# Altium project GPS_TRACKER_IREC.PrjPcb
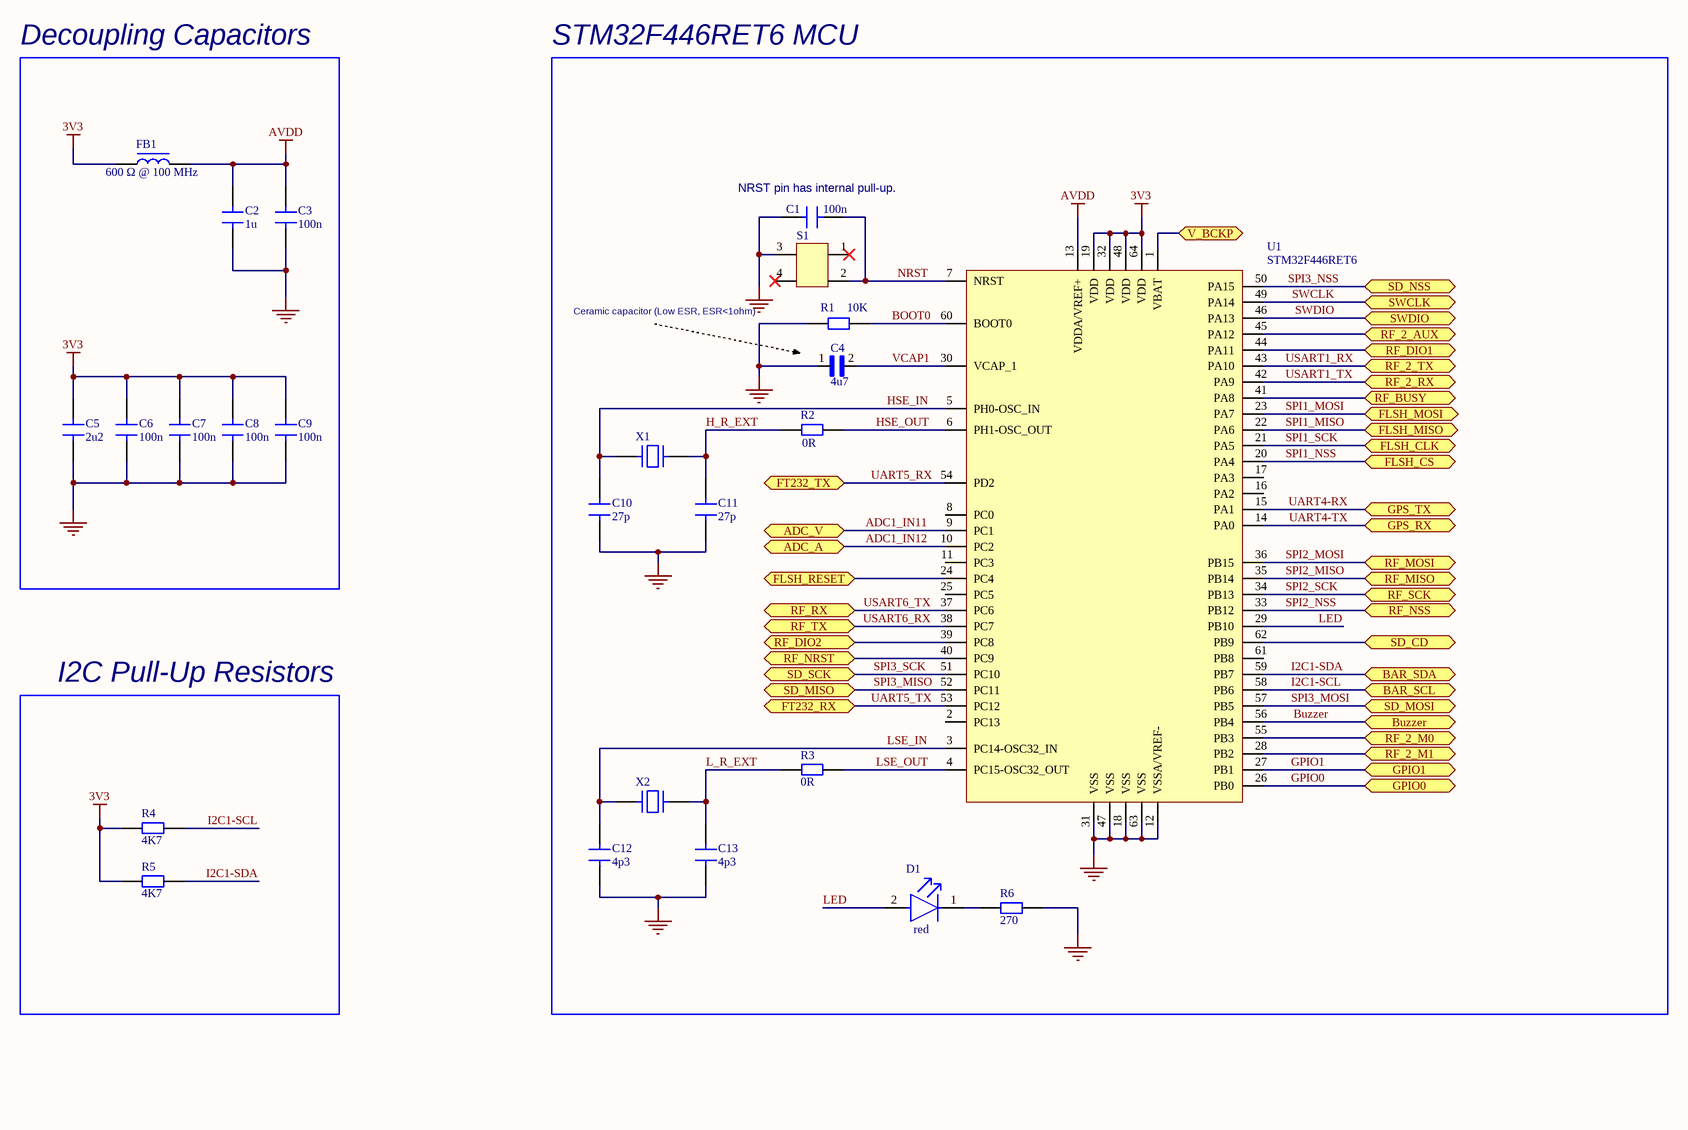
[diagram p0: MCU.SchDoc]
1 sheet, 25 parts. Net scope: flat (ports and power ports of the same name join across sheets).
Board files: V1.PcbDoc, V2_1mini.PcbDoc, V1_x2LoRa.PcbDoc, ciftLoRaTracker.PcbDoc, GOK-HAN_TRACKER.PcbDoc

## Sheet MCU.SchDoc
size A3; SheetNumber: 1; SheetTotal: 4

### Parts
C1  100n  [CAP 0603]
C2  1u  [CAP 0805]
C3  100n  [CAP 0805]
C4  4u7  [CAPC3216X180N]
C5  2u2  [CAP 0805]
C6  100n  [CAP 0805]
C7  100n  [CAP 0805]
C8  100n  [CAP 0805]
C9  100n  [CAP 0805]
C10  27p  [CAP 0805]
C11  27p  [CAP 0805]
C12  4p3  [CAP 0805]
C13  4p3  [CAP 0805]
D1  red  [FP-LTST-C170GKT-MFG]
FB1  600 Ω @ 100 MHz  [FB 0805]
R1  10K  [RES 0805]
R2  0R  [RES 0805]
R3  0R  [RES 0805]
R4  4K7  [RES 0805]
R5  4K7  [RES 0805]
R6  270  [RES 0805]
S1  FSM4JSMATR  [FSM4JSMATR]  (value not drawn)
U1  STM32F446RET6  [STM32F446RET6]
X1  ABM3-8.000MHZ-D2Y-T  [ABM3-8.000MHZ-D2Y-T]  (value not drawn)
X2  ABS25-32.768KHZ-6-T  [ABS25-32.768KHZ-6-T]  (value not drawn)

### Blocks framed on the sheet
Decoupling Capacitors: C2 C3 C5-C9 FB1
STM32F446RET6 MCU: C1 C4 C10-C13 D1 R1-R3 R6 S1 U1 X1 X2
I2C Pull-Up Resistors: R4 R5

### Ports
ADC_A (bidir, see POWER[3D]), ADC_V (bidir, see POWER[1D]), BAR_SCL (bidir, see CONNECTORS[7C], PERIPHERALS[6B]), BAR_SDA (bidir, see CONNECTORS[7C], PERIPHERALS[6B]), Buzzer (bidir, see PERIPHERALS[1C]), FLSH_CLK (bidir, see PERIPHERALS[5B]), FLSH_CS (bidir, see PERIPHERALS[4A]), FLSH_MISO (bidir, see PERIPHERALS[4B]), FLSH_MOSI (bidir, see PERIPHERALS[5B]), FLSH_RESET (bidir, see PERIPHERALS[6B]), FT232_RX (bidir, see CONNECTORS[3A]), FT232_TX (bidir, see CONNECTORS[3A]), GPIO0 (bidir, see CONNECTORS[3C]), GPIO1 (bidir, see CONNECTORS[3C]), GPS_RX (bidir, see PERIPHERALS[2B]), GPS_TX (bidir, see PERIPHERALS[2B]), RF_2_AUX (bidir, see PERIPHERALS[7C]), RF_2_M0 (bidir, see PERIPHERALS[7C]), RF_2_M1 (bidir, see PERIPHERALS[7C]), RF_2_RX (bidir, see PERIPHERALS[7C]), RF_2_TX (bidir, see PERIPHERALS[7C]), RF_BUSY (bidir, see PERIPHERALS[4C]), RF_DIO1 (bidir, see PERIPHERALS[4C]), RF_DIO2 (bidir, see PERIPHERALS[4C]), RF_MISO (bidir, see PERIPHERALS[4C]), RF_MOSI (bidir, see PERIPHERALS[4C]), RF_NRST (bidir, see PERIPHERALS[4C]), RF_NSS (bidir, see PERIPHERALS[4D]), RF_RX (bidir, see PERIPHERALS[4C]), RF_SCK (bidir, see PERIPHERALS[4C]), RF_TX (bidir, see PERIPHERALS[4C]), SD_CD (bidir, see CONNECTORS[5B]), SD_MISO (bidir, see CONNECTORS[5A]), SD_MOSI (bidir, see CONNECTORS[5A]), SD_NSS (bidir, see CONNECTORS[5B]), SD_SCK (bidir, see CONNECTORS[5A]), SWCLK (bidir, see CONNECTORS[2C], CONNECTORS[7B]), SWDIO (bidir, see CONNECTORS[2C], CONNECTORS[7B]), V_BCKP (bidir, see PERIPHERALS[2A], POWER[4D])

### Nets
3V3: C5.2 C6.2 C7.2 C8.2 C9.2 FB1.1 R4.1 R5.1 U1.19(VDD) U1.32(VDD) U1.48(VDD) U1.64(VDD)
AVDD: C2.2 C3.2 FB1.2 U1.13(VDDA/VREF+)
GND: C1.1 C2.1 C3.1 C4.1 C5.1 C6.1 C7.1 C8.1 C9.1 C10.1 C11.1 C12.1 C13.1 R1.1 R6.1 S1.3 U1.12(VSSA/VREF-) U1.18(VSS) U1.31(VSS) U1.47(VSS) U1.63(VSS)
ADC1_IN11: U1.9(PC1) ; port ADC_V
ADC1_IN12: U1.10(PC2) ; port ADC_A
BOOT0: R1.2 U1.60(BOOT0)
Buzzer: U1.56(PB4) ; port Buzzer
GPIO0: U1.26(PB0) ; port GPIO0
GPIO1: U1.27(PB1) ; port GPIO1
H_R_EXT: C11.2 R2.1 X1.2
HSE_IN: C10.2 U1.5(PH0-OSC_IN) X1.1
HSE_OUT: R2.2 U1.6(PH1-OSC_OUT)
I2C1-SCL: R4.2 U1.58(PB6) ; port BAR_SCL
I2C1-SDA: R5.2 U1.59(PB7) ; port BAR_SDA
L_R_EXT: C13.2 R3.1 X2.4
LED: D1.2(A) U1.29(PB10)
LSE_IN: C12.2 U1.3(PC14-OSC32_IN) X2.1
LSE_OUT: R3.2 U1.4(PC15-OSC32_OUT)
NRST: C1.2 S1.2 U1.7(NRST)
SPI1_MISO: U1.22(PA6) ; port FLSH_MISO
SPI1_MOSI: U1.23(PA7) ; port FLSH_MOSI
SPI1_NSS: U1.20(PA4) ; port FLSH_CS
SPI1_SCK: U1.21(PA5) ; port FLSH_CLK
SPI2_MISO: U1.35(PB14) ; port RF_MISO
SPI2_MOSI: U1.36(PB15) ; port RF_MOSI
SPI2_NSS: U1.33(PB12) ; port RF_NSS
SPI2_SCK: U1.34(PB13) ; port RF_SCK
SPI3_MISO: U1.52(PC11) ; port SD_MISO
SPI3_MOSI: U1.57(PB5) ; port SD_MOSI
SPI3_NSS: U1.50(PA15) ; port SD_NSS
SPI3_SCK: U1.51(PC10) ; port SD_SCK
SWCLK: U1.49(PA14) ; port SWCLK
SWDIO: U1.46(PA13) ; port SWDIO
UART4-RX: U1.15(PA1) ; port GPS_TX
UART4-TX: U1.14(PA0) ; port GPS_RX
UART5_RX: U1.54(PD2) ; port FT232_TX
UART5_TX: U1.53(PC12) ; port FT232_RX
USART1_RX: U1.43(PA10) ; port RF_2_TX
USART1_TX: U1.42(PA9) ; port RF_2_RX
USART6_RX: U1.38(PC7) ; port RF_TX
USART6_TX: U1.37(PC6) ; port RF_RX
VCAP1: C4.2 U1.30(VCAP_1)
NetD1_1: D1.1(C) R6.2
NetU1_1: U1.1(VBAT) ; port V_BCKP
NetU1_24: U1.24(PC4) ; port FLSH_RESET
NetU1_28: U1.28(PB2) ; port RF_2_M1
NetU1_39: U1.39(PC8) ; port RF_DIO2
NetU1_40: U1.40(PC9) ; port RF_NRST
NetU1_41: U1.41(PA8) ; port RF_BUSY
NetU1_44: U1.44(PA11) ; port RF_DIO1
NetU1_45: U1.45(PA12) ; port RF_2_AUX
NetU1_55: U1.55(PB3) ; port RF_2_M0
NetU1_62: U1.62(PB9) ; port SD_CD

Not connected (* = marked no-connect by the designer): S1 1* 4*; U1 2(PC13) 8(PC0) 11(PC3) 16(PA2) 17(PA3) 25(PC5) 61(PB8)

### Notes on the sheet
- (near C1) NRST pin has internal pull-up.
- Ceramic capacitor (Low ESR, ESR<1ohm)

### Library data of the parts
C1 = CAP 0603 50V: Capacitor SMD 0603 50V
C2 C3 C6-C13 = CAP 0805 50V: Capacitor SMD 0805 50V
C4 = UMK316ABJ475MLHT: 4.7uF, CAP, MLCC, 1206, 50V, X5R, 4.7UF20%, T&R; Package: None; Price: None; Value: *; MP: UMK316ABJ475MLHT; Availability: Unavailable
C5 = CAP 0805 25V: Capacitor SMD 0805 25V
D1 = CMP-1674-00002-6: LED GREEN CLEAR SMD; Dominant Wavelength: 569nm; Lens Style: Diffused; Forward Voltage: 2.1V; Number of Elements: 1; Wavelength: 565nm; Luminous Intensity: 6mcd; Test Current: 10mA; Power Dissipation: 100mW; Reverse Voltage: 5V; Forward Current: 30mA; Viewing Angle: 130°; Lens Color: Colorless; Min Operating Temperature: -55°C; Number of Pins: 2; Max Operating Temperature: 85°C; Color: Green; Radiation Hardening: No; Illumination Color: Green; Case Code (Metric): 2012; Lens Transparency: Clear; Case/Package: 0805; Width: 1.25mm; Case Code (Imperial): 0805; Package Quantity: 1; Height: 1.1mm; Depth: 1.25mm; Length: 2mm; Power Rating: 100mW; Lead Free: Lead Free; Number of LEDs: 1; Packaging: Tape and Reel; Mount: Surface Mount; Voltage: 5V
FB1 = FB 0805: Ferrite Bead SMD 0805
R1-R6 = RES 0805: Resistor SMD 0805
S1 = FSM4JSMATR: Switch Tactile OFF (ON) SPST Round Button Gull Wing 0.05A 24VDC 1.57N SMD T/R; Manufacturer: TE Connectivity Alcoswitch; Supplier 1: Digi-Key; Manufacturer Part Number: FSM4JSMATR; RoHS: Yes; Category: Pushbutton Switches; Stock 1: 84996; Pricing 1: 1=0,36, 10=0,351, 25=0,33, 100=0,2866, 250=0,26, 500=0,24188 (USD); ComponentLink1URL: https://datasheet.ciiva.com/16320/eng-cs-1308111-1-switches-core-program-catalog-0308-16320065.pdf?src-supplier=Future+Electronics; ComponentLink1Description: https://datasheet.ciiva.com/16320/eng-cs-1308111-1-switches-core-program-catalog-0308-16320065.pdf?src-supplier=Future+Electronics; ComponentLink2URL: https://datasheet.ciiva.com/1530/1683375-1530944.pdf?src-supplier=Element14; ComponentLink2Description: https://datasheet.ciiva.com/1530/1683375-1530944.pdf?src-supplier=Element14; ComponentLink3URL: https://datasheet.ciiva.com/23765/1486934-23765878.pdf?src-supplier=Newark; ComponentLink3Description: https://datasheet.ciiva.com/23765/1486934-23765878.pdf?src-supplier=Newark; ComponentLink4URL: https://datasheet.ciiva.com/7638/921681-7638037.pdf?src-supplier=Element14; ComponentLink4Description: https://datasheet.ciiva.com/7638/921681-7638037.pdf?src-supplier=Element14
U1 = STM32F446RET6: ARM® Cortex®-M4 STM32 F4 Microcontroller IC 32-Bit 180MHz 512KB (512K x 8) FLASH 64-LQFP (10x10); Manufacturer: STMicroelectronics; Supplier 1: Mouser; Manufacturer Part Number: STM32F446RET6; RoHS: Yes; Category: Microcontrollers; Stock 1: 2954; Pricing 1: 1=12,45, 10=11,25, 50=10,54, 100=9,5, 1000=6,72, 10000=6,72 (USD); ComponentLink1URL: http://www.mouser.com/ds/2/389/stm32f446mc-956216.pdf?src-supplier=Mouser; ComponentLink1Description: http://www.mouser.com/ds/2/389/stm32f446mc-956216.pdf?src-supplier=Mouser; ComponentLink2URL: http://www.farnell.com/datasheets/2309063.pdf?src-supplier=Farnell; ComponentLink2Description: http://www.farnell.com/datasheets/2309063.pdf?src-supplier=Farnell; ComponentLink3URL: https://datasheet.octopart.com/STM32F446RET6-STMicroelectronics-datasheet-58295083.pdf?src-supplier=Future+Electronics; ComponentLink3Description: https://datasheet.octopart.com/STM32F446RET6-STMicroelectronics-datasheet-58295083.pdf?src-supplier=Future+Electronics; ComponentLink4URL: http://www.st.com/content/ccc/resource/technical/document/datasheet/65/cb/75/50/53/d6/48/24/DM00141306.pdf/files/DM00141306.pdf/jcr:content/translations/en.DM00141306.pdf?src-supplier=Digi-Key; ComponentLink4Description: http://www.st.com/content/ccc/resource/technical/document/datasheet/65/cb/75/50/53/d6/48/24/DM00141306.pdf/files/DM00141306.pdf/jcr:content/translations/en.DM00141306.pdf?src-supplier=Digi-Key; ComponentLink5URL: http://www.farnell.com/datasheets/2309063.pdf?src-supplier=Element14; ComponentLink5Description: http://www.farnell.com/datasheets/2309063.pdf?src-supplier=Element14; ComponentLink6URL: https://datasheet.octopart.com/STM32F446RET6-STMicroelectronics-datasheet-41797127.pdf?src-supplier=Element14; ComponentLink6Description: https://datasheet.octopart.com/STM32F446RET6-STMicroelectronics-datasheet-41797127.pdf?src-supplier=Element14; ComponentLink7URL: http://www.farnell.com/datasheets/2309063.pdf?src-supplier=Newark; ComponentLink7Description: http://www.farnell.com/datasheets/2309063.pdf?src-supplier=Newark; ComponentLink8URL: https://datasheet.octopart.com/STM32F446RET6-STMicroelectronics-datasheet-83961502.pdf?src-supplier=SHENGYU+ELECTRONICS; ComponentLink8Description: https://datasheet.octopart.com/STM32F446RET6-STMicroelectronics-datasheet-83961502.pdf?src-supplier=SHENGYU+ELECTRONICS
X1 = ABM3-8.000MHZ-D2Y-T: Crystal 8MHz ±20ppm (Tol) ±30ppm (Stability) 18pF FUND 140Ohm 2-Pin Mini-CSMD T/R; Manufacturer: Abracon; Supplier 1: Future Electronics; Manufacturer Part Number: ABM3-8.000MHZ-D2Y-T; RoHS: Yes; Category: Crystals; Stock 1: 237000; Pricing 1: 1000=0,325, 2000=0,275, 3000=0,315, 4000=0,27, 5000=0,31, 10000=0,305, 20000=0,295 (USD); Reach SVHC Compliant: 4187SVHC; ComponentLink1URL: https://datasheet.ciiva.com/862/abm3-862465.pdf?src-supplier=Digikey; ComponentLink1Description: https://datasheet.ciiva.com/862/abm3-862465.pdf?src-supplier=Digikey
X2 = ABS25-32.768KHZ-6-T: Crystal, Plastic Molded 32.768Khz, 6Pf, 20Ppm-40+85C, 8 X 3.8 X 2.5 Rohs Compliant: Yes; Manufacturer: Abracon; Supplier 1: Future Electronics; Manufacturer Part Number: ABS25-32.768KHZ-6-T; RoHS: Yes; Category: Crystals; Stock 1: 399000; Pricing 1: 3000=0,375, 6000=0,365, 9000=0,365, 12000=0,36, 15000=0,35 (USD); ComponentLink1URL: https://datasheet.ciiva.com/854/abs25-854528.pdf?src-supplier=Digi-Key; ComponentLink1Description: https://datasheet.ciiva.com/854/abs25-854528.pdf?src-supplier=Digi-Key; ComponentLink2URL: https://datasheet.ciiva.com/26909/getdatasheetpartid-722397-26909970.pdf?src-supplier=Verical; ComponentLink2Description: https://datasheet.ciiva.com/26909/getdatasheetpartid-722397-26909970.pdf?src-supplier=Verical; ComponentLink3URL: https://datasheet.ciiva.com/854/abs25-854527.pdf?src-supplier=Digi-Key; ComponentLink3Description: https://datasheet.ciiva.com/854/abs25-854527.pdf?src-supplier=Digi-Key; ComponentLink4URL: https://datasheet.ciiva.com/854/abs25-854529.pdf?src-supplier=Digi-Key; ComponentLink4Description: https://datasheet.ciiva.com/854/abs25-854529.pdf?src-supplier=Digi-Key; ComponentLink5URL: https://datasheet.ciiva.com/5788/abs25-5788102.pdf?src-supplier=Farnell; ComponentLink5Description: https://datasheet.ciiva.com/5788/abs25-5788102.pdf?src-supplier=Farnell; ComponentLink6URL: https://datasheet.ciiva.com/1357/1856019-1357324.pdf?src-supplier=Element14; ComponentLink6Description: https://datasheet.ciiva.com/1357/1856019-1357324.pdf?src-supplier=Element14; ComponentLink7URL: https://datasheet.ciiva.com/7998/1856019-7998662.pdf?src-supplier=Element14; ComponentLink7Description: https://datasheet.ciiva.com/7998/1856019-7998662.pdf?src-supplier=Element14